# EAGLE design main_board (EAGLE 7.6.0)
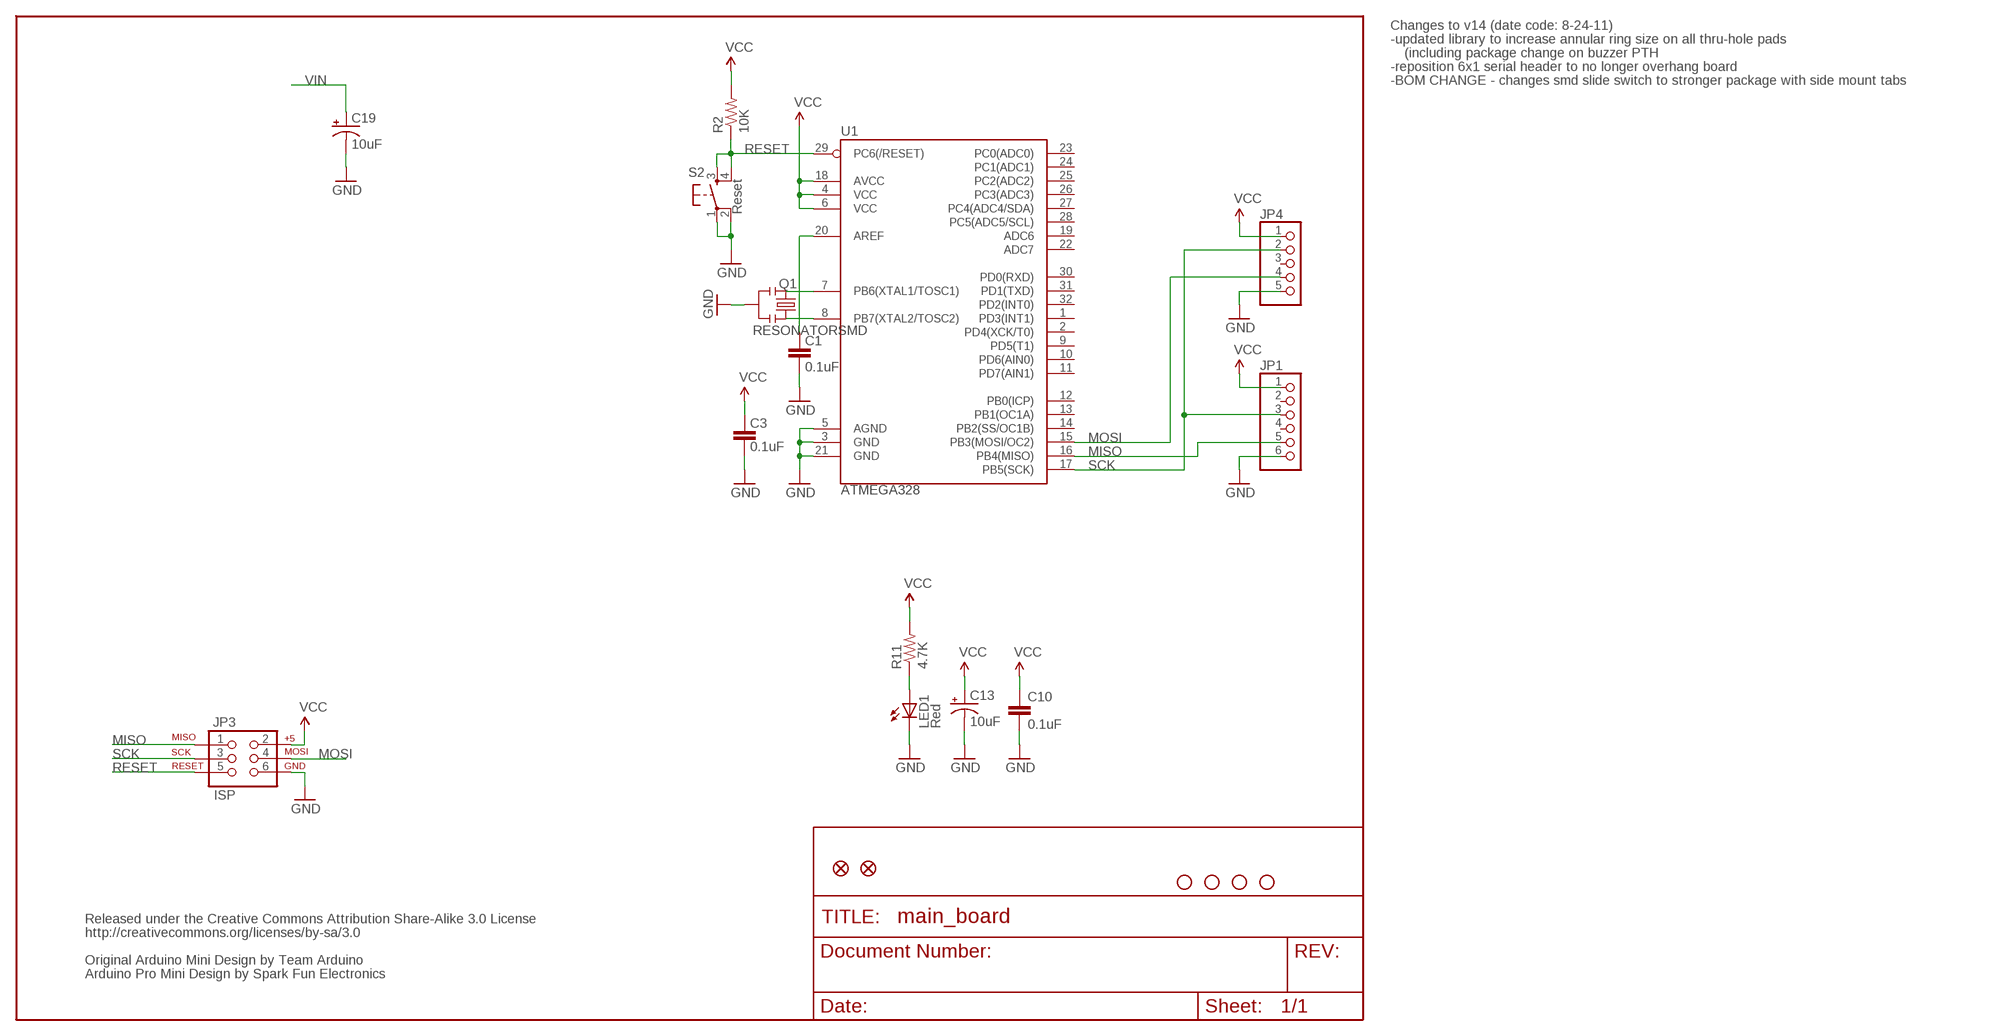
[diagram p0: schematic, sheet 1]

## Parts
C1  0.1uF  CAP0402-CAP  [0402-CAP]
C3  0.1uF  CAP0402-CAP  [0402-CAP]
C10  0.1uF  CAP0402-CAP  [0402-CAP]
C13  10uF  CAP_POL1206  [EIA3216]
C19  10uF  CAP_POL1206  [EIA3216]
JP1  PINHD-1X6  [1X06]
JP2  FIDUCIAL1X2.5  [FIDUCIAL-1X2.5]
JP3  ISP  AVR_SPI_PRG_6PTH  [2X3]
JP4  PINHD-1X5  [1X05]
JP5  FIDUCIAL1X2.5  [FIDUCIAL-1X2.5]
LED1  Red  LED0603  [LED-0603]
Q1  RESONATORSMD  [RESONATOR-SMD]
R2  10K  RESISTOR0402-RES  [0402-RES]
R11  4.7K  RESISTOR0402-RES  [0402-RES]
S2  Reset  TAC_SWITCHSMD  [TACTILE_SWITCH_SMD]
U1  ATMEGA328  ATMEGA168  [TQFP32-08]
U$1  STAND-OFF  [STAND-OFF]
U$3  STAND-OFF  [STAND-OFF]
U$9  STAND-OFF  [STAND-OFF]
U$10  STAND-OFF  [STAND-OFF]

## Nets
AREF: C1.2 U1.20(AREF)
GND [vcc]: C1.1 C3.1 C10.2 C13.C(-) C19.C(-) JP1.6 JP3.6 JP4.5 LED1.C Q1.2 S2.1 S2.2 U1.3(GND) U1.5(AGND) U1.21(GND)
MISO: JP1.5 JP3.1 U1.16(PB4(MISO))
MOSI: JP3.4 JP4.4 U1.15(PB3(MOSI/OC2))
N$3: Q1.1 U1.8(PB7(XTAL2/TOSC2))
N$4: Q1.3 U1.7(PB6(XTAL1/TOSC1))
N$38: LED1.A R11.1
RESET: JP3.5 R2.1 S2.3 S2.4 U1.29(PC6(/RESET))
SCK: JP1.3 JP3.3 JP4.2 U1.17(PB5(SCK))
VCC: C3.2 C10.1 C13.A(+) JP1.1 JP3.2 JP4.1 R2.2 R11.2 U1.4(VCC) U1.6(VCC) U1.18(AVCC)
VIN [vcc]: C19.A(+)
Unconnected: JP1.2 JP1.4 JP4.3 U1.1(PD3(INT1)) U1.2(PD4(XCK/T0)) U1.9(PD5(T1)) U1.10(PD6(AIN0)) U1.11(PD7(AIN1)) U1.12(PB0(ICP)) U1.13(PB1(OC1A)) U1.14(PB2(SS/OC1B)) U1.19(ADC6) U1.22(ADC7) U1.23(PC0(ADC0)) U1.24(PC1(ADC1)) U1.25(PC2(ADC2)) U1.26(PC3(ADC3)) U1.27(PC4(ADC4/SDA)) U1.28(PC5(ADC5/SCL)) U1.30(PD0(RXD)) U1.31(PD1(TXD)) U1.32(PD2(INT0))

## Notes on the sheet
- Changes to v14 (date code: 8-24-11)
- -updated library to increase annular ring size on all thru-hole pads
- (including package change on buzzer PTH
- -reposition 6x1 serial header to no longer overhang board
- -BOM CHANGE - changes smd slide switch to stronger package with side mount tabs
- Released under the Creative Commons Attribution Share-Alike 3.0 License
- http://creativecommons.org/licenses/by-sa/3.0
- Original Arduino Mini Design by Team Arduino
- Arduino Pro Mini Design by Spark Fun Electronics

## Library data of the parts
C1 C3 C10 = SparkFun:CAP: Capacitor Standard 0603 ceramic capacitor, and 0.1" leaded capacitor.
C13 C19 = SparkFun:CAP_POL: Capacitor Polarized These are standard SMD and PTH capacitors. Normally 10uF, 47uF, and 100uF in electrolytic and tantalum varieties. Always verify the external diameter of the through hole cap, it varies with capacity, voltage, and manufacturer. The EIA devices should be standard.
JP1 = pinhead:PINHD-1X6: PIN HEADER
JP2 JP5 = abes:FIDUCIAL: Fiducial Alignment Points Various fiducial points for machine vision alignment.
JP3 = SparkFun:AVR_SPI_PRG_6: AVR ISP 6 Pin This is the reduced ISP connector for AVR programming. Common on Arduino. This footprint will take up less PCB space and can be used with a 10-pin to 6-pin adapter such as SKU: BOB-08508
JP4 = pinhead:PINHD-1X5: PIN HEADER
LED1 = SparkFun:LED: LEDs Standard schematic elements and footprints for 5mm, 3mm, 1206, and 0603 sized LEDs. 5mm - Spark Fun Electronics SKU : COM-00529 (and others)
Q1 = SparkFun:RESONATOR: Resonator Small SMD resonator. This is the itty bitty 10/20MHz resonators with built in caps. CSTCE10M0G55 and CSTCE20M0V53. Footprint has been reviewed closely but hasn't been tested yet.
R2 R11 = SparkFun:RESISTOR: Resistor Basic schematic elements and footprints for 0603, 1206, and PTH resistors.
S2 = SparkFun:TAC_SWITCH: Momentary Switch Button commonly used for reset or general input. Spark Fun Electronics SKU : COM-00097
U1 = SparkFun:ATMEGA168
U$1 U$3 U$9 U$10 = SparkFun:STAND-OFF: Stand Off This is the mechanical footprint for a #4 phillips button head screw. Use the keepout ring to avoid running the screw head into surrounding components. SKU : PRT-00447

## Net classes
0 default: width 0.203 mm
1 vcc: width 0.254 mm

## Board
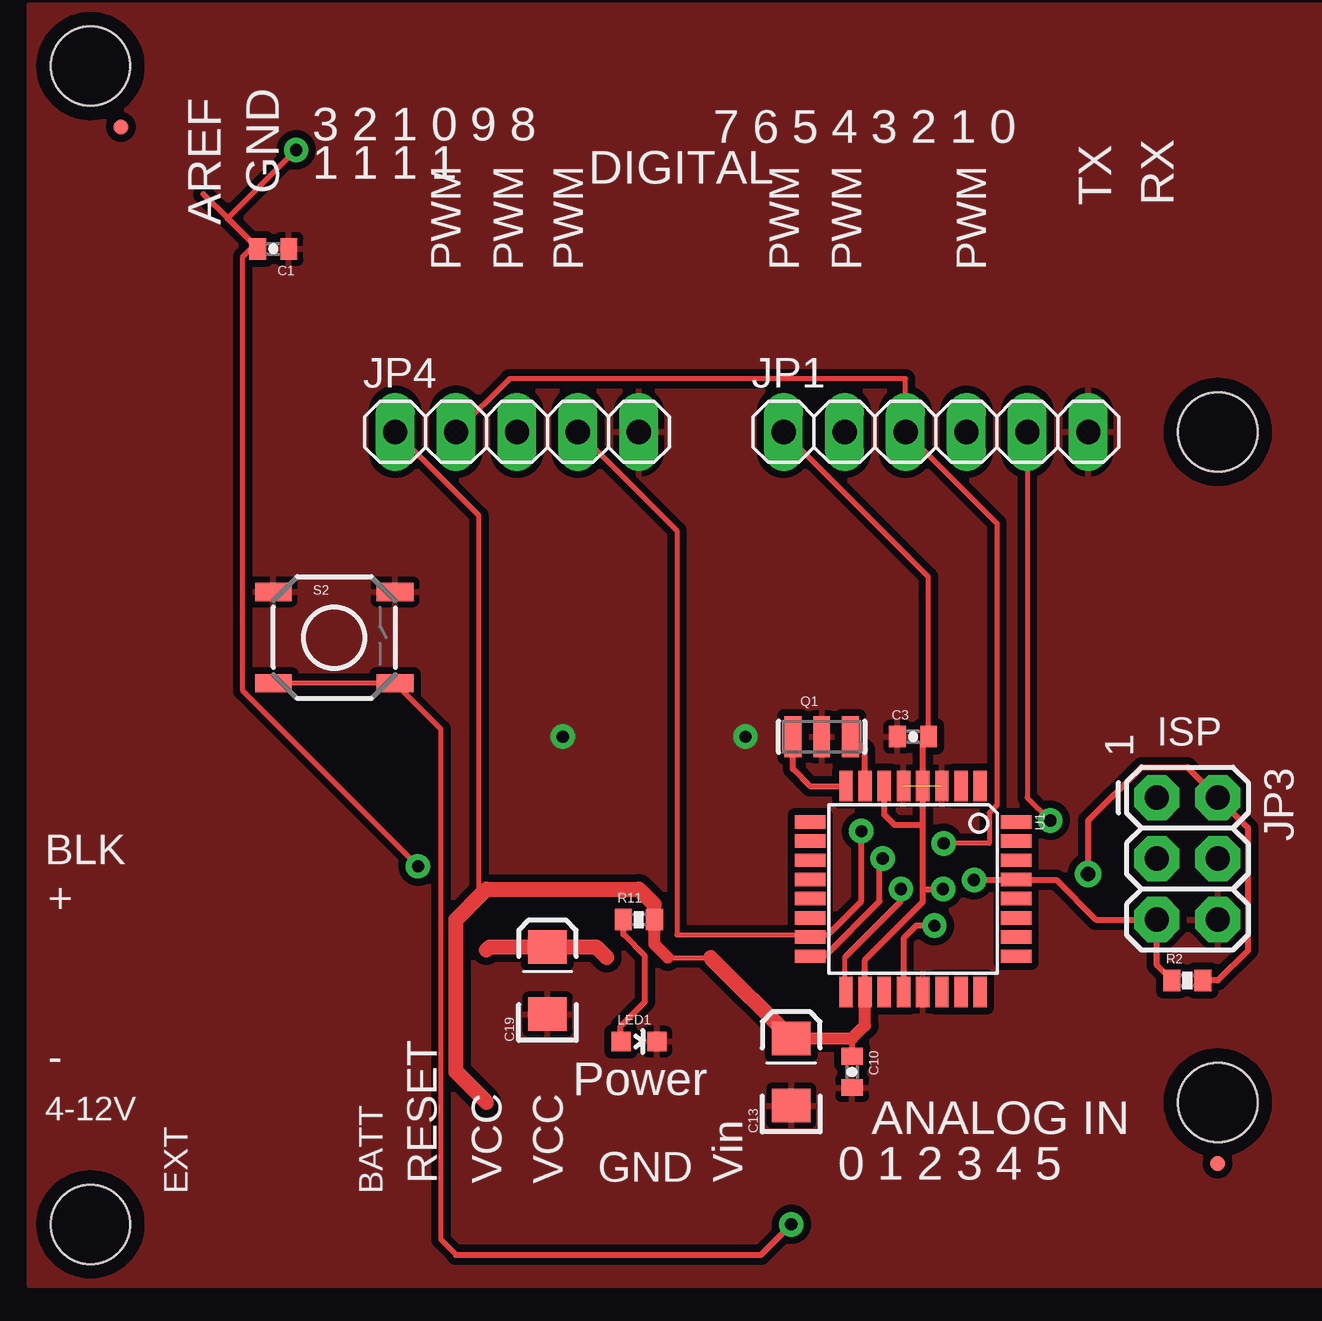
[diagram p1: board, top side]
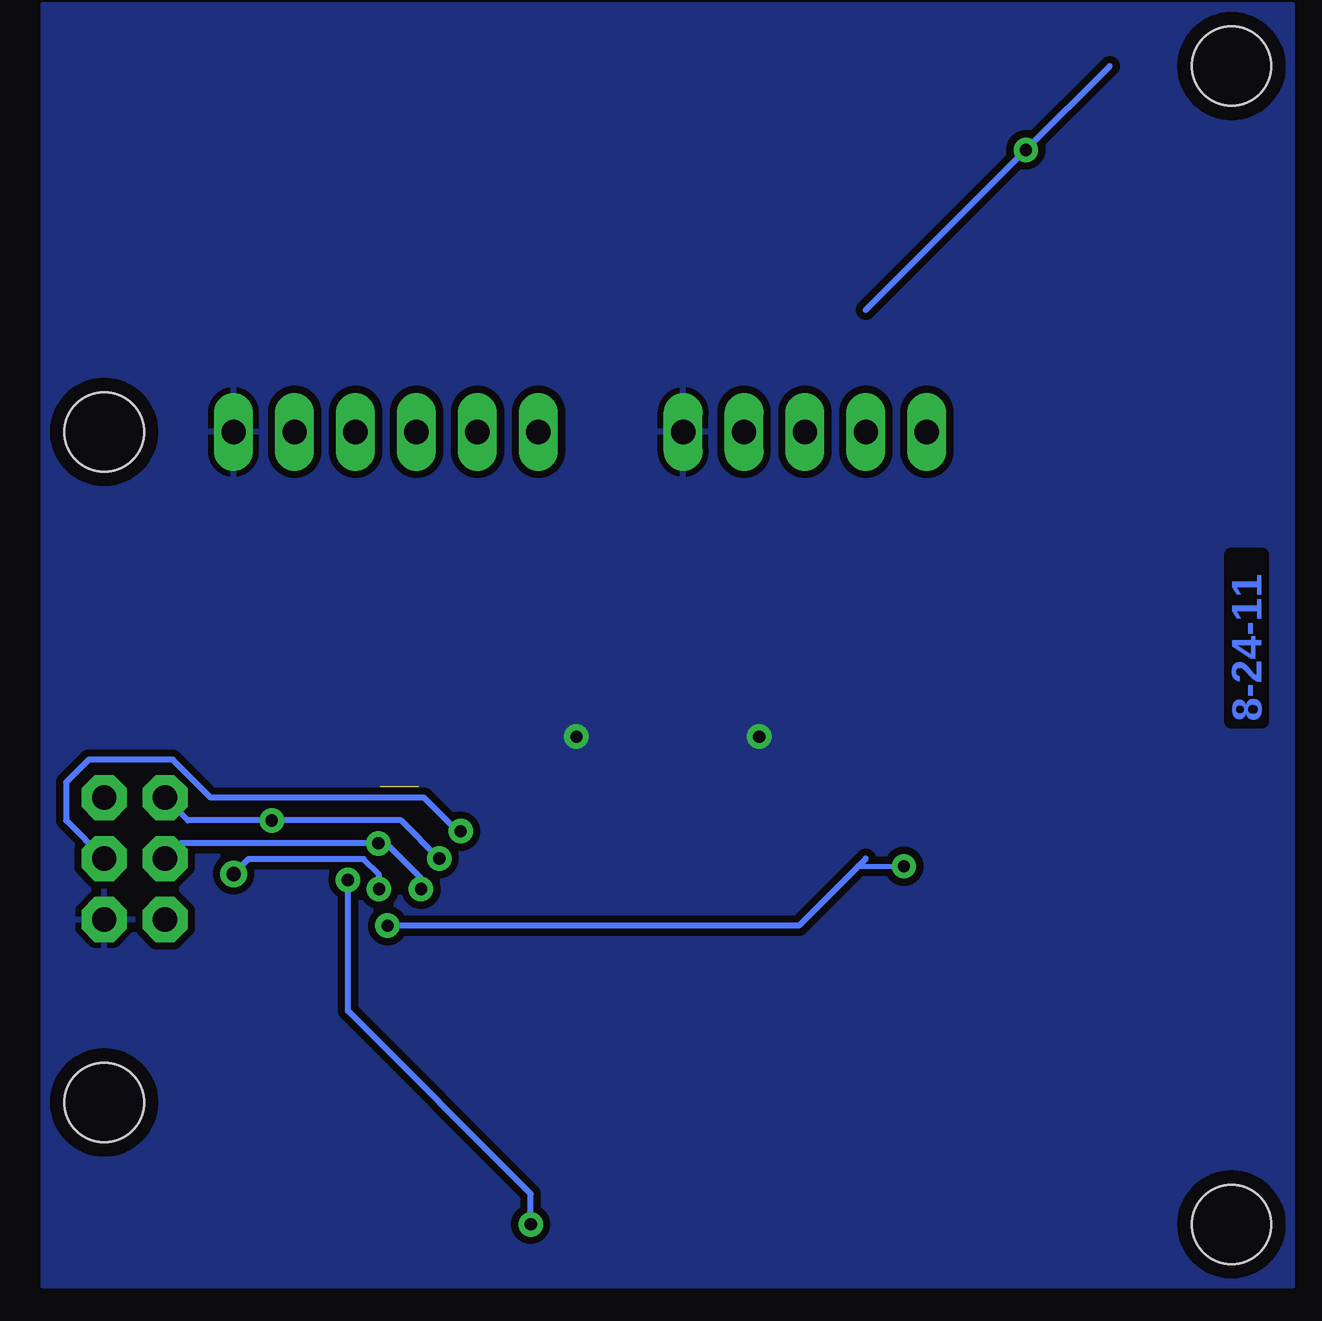
[diagram p2: board, bottom side, seen from below]

No outline drawn. Coordinates in mm, seen from the top.
Copper layers (1*16): Top 0.035mm / dielectric 1.5mm / Bottom 0.035mm
Design rules "SparkFun": minimum track width 8mil, minimum drill 20mil, track to track 8mil, track to pad 8mil, pad to pad 8mil, via to via 8mil, smd to smd 8mil, copper to edge 10mil, drill to drill 8mil, minimum pad ring 12mil, minimum via ring 10mil, stop-mask expansion 4mil, vias tented up to drill 20mil, thermal gap 10mil

### Footprints (pad centres in the part's own frame; a part is rotated, then mirrored left to right if it is on the bottom)
0402-CAP = smd 0.7 x 0.9: 1 -0.65,0; 2 0.65,0
EIA3216 = smd 1.4 x 1.6: A 1.4,0; C -1.4,0
1X06 = drill 1.016 long: 1 -6.35,0; 2 -3.81,0; 3 -1.27,0; 4 1.27,0; 5 3.81,0; 6 6.35,0
FIDUCIAL-1X2.5 = smd 0.635 x 0.635: 1 0,0
2X3 = drill 1.016 pad 1.88 octagon: 1 0,0; 2 0,2.54; 3 2.54,0; 4 2.54,2.54; 5 5.08,0; 6 5.08,2.54
1X05 = drill 1.016 long: 1 -5.08,0; 2 -2.54,0; 3 0,0; 4 2.54,0; 5 5.08,0
LED-0603 = smd 0.8 x 0.8: A 0,-0.75; C 0,0.75
RESONATOR-SMD = smd 0.7 x 1.7: 1 -1.2,0; 2 0,0; 3 1.2,0
0402-RES = smd 0.7 x 0.9: 1 -0.65,0; 2 0.65,0
TACTILE_SWITCH_SMD = smd 1.524 x 0.762: 1 -2.54,1.905; 2 2.54,1.905; 3 -2.54,-1.905; 4 2.54,-1.905
TQFP32-08 = smd 1.27 x 0.559: 1 -4.293,2.8; 2 -4.293,2; 3 -4.293,1.2; 4 -4.293,0.4; 5 -4.293,-0.4; 6 -4.293,-1.2; 7 -4.293,-2; 8 -4.293,-2.8; 17 4.293,-2.8; 18 4.293,-2; 19 4.293,-1.2; 20 4.293,-0.4; 21 4.293,0.4; 22 4.293,1.2; 23 4.293,2; 24 4.293,2.8 | smd 0.559 x 1.27: 9 -2.8,-4.293; 10 -2,-4.293; 11 -1.2,-4.293; 12 -0.4,-4.293; 13 0.4,-4.293; 14 1.2,-4.293; 15 2,-4.293; 16 2.8,-4.293; 25 2.8,4.293; 26 2,4.293; 27 1.2,4.293; 28 0.4,4.293; 29 -0.4,4.293; 30 -1.2,4.293; 31 -2,4.293; 32 -2.8,4.293
STAND-OFF = hole 3.302: 0,0

### Placement (x,y rotation side)
C1  10.16,43.18 180 top
C3  36.83,22.86 0 top
C10  34.29,8.89 270 top
C13  31.75,8.89 90 top
C19  21.59,12.7 90 top
JP1  37.78,35.56 0 top
JP2  49.53,5.08 0 top
JP3  46.99,20.32 270 top
JP4  20.32,35.56 0 top
JP5  3.81,48.26 0 top
LED1  25.4,10.16 270 top
Q1  33.02,22.86 0 top
R2  48.26,12.7 0 top
R11  25.4,15.24 0 top
S2  12.7,26.99 0 top
U1  36.83,16.51 270 top
U$1  2.54,50.8 0 top
U$3  2.54,2.54 0 top
U$9  49.53,35.56 0 top
U$10  49.53,7.62 0 top

### Tracks (layer width: path | path; a pad name or v marks a point on that pad's centre or on a via)
AREF  (via drill 0.51)
  Top 0.203: v11.11,47.31 8.26,44.45 | v16.19,17.46 8.89,24.77 8.89,42.86 9.21,43.18 C1.2
  Top 0.254: U1.20 36.43,14.46 36.96,14.99 v37.72,14.99 | C1.2 9.53,43.18 8.26,44.45 7.24,45.47
  Bottom 0.203: 18.1,17.46 v16.19,17.46
  Bottom 0.254: v37.72,14.99 20.57,14.99 18.1,17.46 17.78,17.78 | 17.78,40.64 v11.11,47.31 7.62,50.8
GND  (via drill 0.51)  (1 unrouted)
  other vias: 29.84,22.86 22.23,22.86
  pour Top (isolate 0.305): 0,53.34 170.18,53.34 170.18,0 0,0
  pour Bottom (isolate 0.305): 0,53.34 52.07,53.34 52.07,0 0,0
MISO  (via drill 0.51)
  Top 0.203: U1.16 32.7,13.65 32.7,13.72 | v42.55,19.37 41.59,20.32 JP1.5
  Top 0.254: 32.63,13.71 32.64,13.72 32.7,13.72 33.15,13.72 35.43,16 35.43,17.65 v35.56,17.78
  Bottom 0.254: v35.56,17.78 37.15,19.37 v42.55,19.37 46.04,19.37 JP3.1
MOSI  (via drill 0.51)
  Top 0.203: 32.73,14.57 32.7,14.61 U1.15 32.38,14.61 26.99,14.61 26.99,31.43 JP4.4
  Top 0.254: 32.57,14.48 32.64,14.48 | v34.67,18.92 34.67,16 33.27,14.61 32.77,14.61 32.73,14.57 32.64,14.48 | 32.61,14.51 32.64,14.48
  Bottom 0.254: v34.67,18.92 34.8,18.92 36.2,20.32 45.09,20.32 46.67,21.91 50.16,21.91 51.12,20.95 51.12,19.37 JP3.4
N$3
  Top 0.254: U1.8 32.54,20.8 31.82,21.52 Q1.1
N$4
  Top 0.254: Q1.3 34.29,22.86 34.83,22.32 U1.7
N$38
  Top 0.254: R11.1 24.75,14.62 25.65,13.72 25.65,11.81 24.64,10.79 24.64,10.16 LED1.A
RESET  (via drill 0.51)
  Top 0.203: S2.3 S2.4 17.14,23.18 17.14,1.91 17.78,1.27
  Top 0.254: 17.78,1.27 30.48,1.27 v31.75,2.54 | v39.37,16.89 41.02,16.89 41.04,16.91 U1.29 41.26,16.91 41.27,16.89 42.8,16.89 44.45,15.24 JP3.5 46.99,13.34 47.62,12.7 R2.1
  Bottom 0.254: v39.37,16.89 39.37,11.43 31.75,3.81 v31.75,2.54
SCK  (via drill 0.51)
  Top 0.203: U1.17 33.97,12.38 33.97,13.65 34.03,13.71 | v38.1,18.41 40.01,18.41 40.01,19.68 40.32,20 40.32,31.75 JP1.3 36.51,37.78 20,37.78 JP4.2
  Top 0.254: v36.32,16.51 36.32,16 34.03,13.71
  Bottom 0.254: v36.32,16.51 36.32,16.95 37.78,18.41 v38.1,18.41 46.35,18.41 JP3.3
VCC  (via drill 0.51, 0.6)
  Top 0.203: JP1.1 37.47,29.53 37.47,22.86 C3.2 | JP4.1 18.73,32.07 18.73,16.51 18.89,16.35 | 28.39,13.65 28.26,13.65 26.67,13.65 26.61,13.65
  Top 0.254: 34.29,10.29 C10.1 | C13.A 31.75,10.16 | 26.54,13.59 26.6,13.65 26.61,13.65 | U1.18 34.82,13.56 37.24,15.98 37.24,16.51 | U1.4 37.24,20.9 | U1.4 37.23,22.57 37.52,22.86 C3.2 | 37.24,16.51 37.24,19.18 | 37.24,19.18 U1.4 | 37.24,16.51 v38.08,16.51 | R2.2 49.53,12.7 50.8,13.97 50.8,19.05 JP3.2 48.26,21.59 46.35,21.59 44.13,19.37 v44.13,17.14 | U1.6 35.63,19.61 36.07,19.18 37.24,19.18
  Top 0.508: U1.18 34.83,10.83 34.29,10.29 31.88,10.29 | 26.05,15.86 R11.2 26.04,15.24 26.04,14.22 26.61,13.65
  Top 0.635: 28.39,13.65 C13.A 31.87,10.29 31.88,10.29 | 26.05,15.86 25.4,16.51 19.05,16.51 18.89,16.35 17.78,15.24 17.78,8.89 19.05,7.62
  Bottom 0.254: v38.08,16.51 38.08,17.12 38.71,17.75 43.52,17.75 v44.13,17.14
VIN
  Top 0.635: 19.05,13.97 19.18,14.1 C19.A 23.62,14.1 24.07,13.65

### Text on the board
Bottom: 8-24-11
tPlace: Released under the Creative Commons Attribution Share-Alike 3.0 License | http://creativecommons.org/licenses/by-sa/3.0 | 3 2 1 0 9 8 | 7 6 5 4 3 2 1 0 | 1 1 1 1 | DIGITAL | GND | TX | RX | AREF | PWM | PWM | PWM | PWM | PWM | PWM | 1 | ISP | BLK | + | - | Power | 4-12V | ANALOG IN | EXT | BATT | RESET | VCC | VCC | GND | Vin | 0 1 2 3 4 5
tValues: DNP | DNP | JST-Right Angle | DNP | Production: DNP | Production: DNP | Proto: 2x3 male header up | DNP | DNP | DNP | Arduino Pro